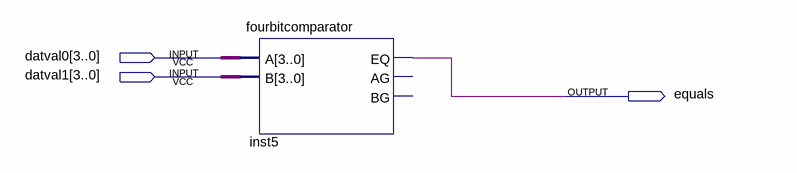
[diagram p0: schematic sheet]
// Quartus schematic test.bdf as structural Verilog: 1 symbols, 3 pins
module test (
  input  [3:0] datval0,
  input  [3:0] datval1,
  output equals
);

  fourbitcomparator inst5 (.A(datval0), .B(datval1), .EQ(equals));  // open: AG, BG
endmodule
